# Altium schematic sheet LPCB228 - TOP.SchDoc
size A3; Address1: Factory 10; Address2: 9-13 Dingley Avenue, Dandeong, VICTORIA 3175, AUSTRALIA; DocumentNumber: 1; Revision: 1; SheetNumber: 1; SheetTotal: 2; Lockie__PCB_SUB_ASSEMBLY: Main; Lockie__PCB_ASSEMBLY: Main; Lockie__LDL: LPCB228; Lockie__PCB_DESCRIPTION: DC/DC Converter
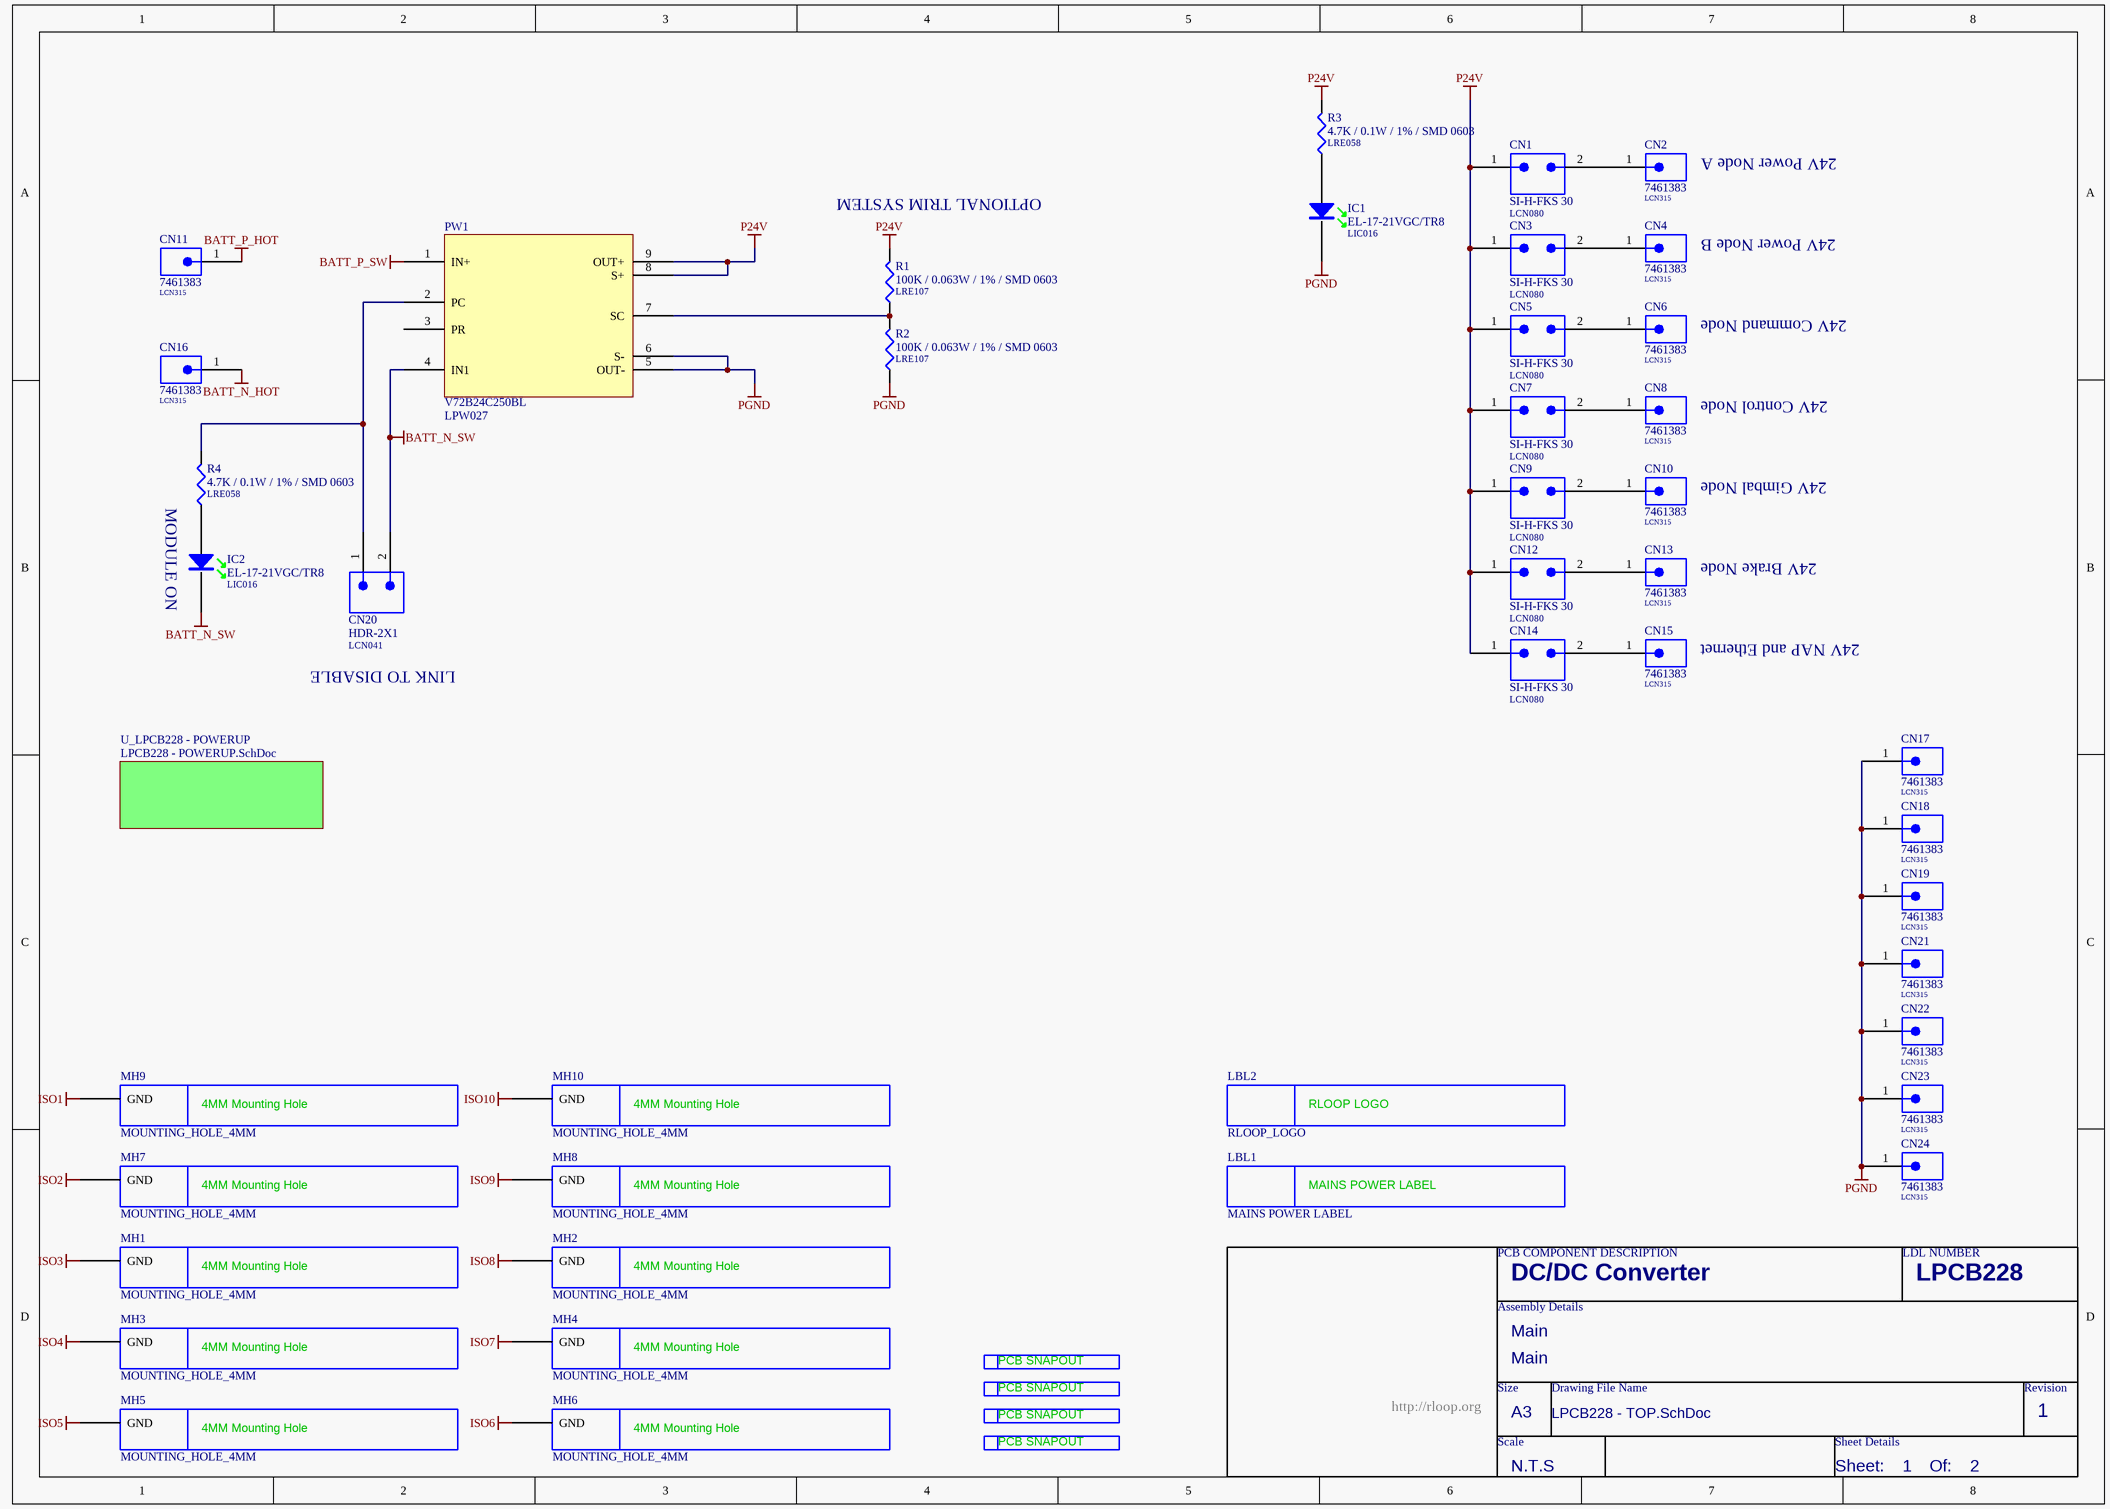
[diagram p0: LPCB228 - TOP.SchDoc]

## Parts
CN1  SI-H-FKS 30  LDL_NUMBER: LCN080  [SI-H-FKS-30]
CN2  7461383  LDL_NUMBER: LCN315  [7461383]
CN3  SI-H-FKS 30  LDL_NUMBER: LCN080  [SI-H-FKS-30]
CN4  7461383  LDL_NUMBER: LCN315  [7461383]
CN5  SI-H-FKS 30  LDL_NUMBER: LCN080  [SI-H-FKS-30]
CN6  7461383  LDL_NUMBER: LCN315  [7461383]
CN7  SI-H-FKS 30  LDL_NUMBER: LCN080  [SI-H-FKS-30]
CN8  7461383  LDL_NUMBER: LCN315  [7461383]
CN9  SI-H-FKS 30  LDL_NUMBER: LCN080  [SI-H-FKS-30]
CN10  7461383  LDL_NUMBER: LCN315  [7461383]
CN11  7461383  LDL_NUMBER: LCN315  [7461383]
CN12  SI-H-FKS 30  LDL_NUMBER: LCN080  [SI-H-FKS-30]
CN13  7461383  LDL_NUMBER: LCN315  [7461383]
CN14  SI-H-FKS 30  LDL_NUMBER: LCN080  [SI-H-FKS-30]
CN15  7461383  LDL_NUMBER: LCN315  [7461383]
CN16  7461383  LDL_NUMBER: LCN315  [7461383]
CN17  7461383  LDL_NUMBER: LCN315  [7461383]
CN18  7461383  LDL_NUMBER: LCN315  [7461383]
CN19  7461383  LDL_NUMBER: LCN315  [7461383]
CN20  HDR-2X1  LDL_NUMBER: LCN041  [HDR-2X1]
CN21  7461383  LDL_NUMBER: LCN315  [7461383]
CN22  7461383  LDL_NUMBER: LCN315  [7461383]
CN23  7461383  LDL_NUMBER: LCN315  [7461383]
CN24  7461383  LDL_NUMBER: LCN315  [7461383]
IC1  EL-17-21VGC/TR8  LDL_NUMBER: LIC016  [CR2012-0805-LED]
IC2  EL-17-21VGC/TR8  LDL_NUMBER: LIC016  [CR2012-0805-LED]
LBL1  MAINS POWER LABEL  [MAINS POWER LABEL]  (no BOM)
LBL2  RLOOP_LOGO  [RLOOP_LOGO]  (no BOM)
MH1  MOUNTING_HOLE_4MM  [MOUNTING_HOLE_4MM]  (no BOM)
MH2  MOUNTING_HOLE_4MM  [MOUNTING_HOLE_4MM]  (no BOM)
MH3  MOUNTING_HOLE_4MM  [MOUNTING_HOLE_4MM]  (no BOM)
MH4  MOUNTING_HOLE_4MM  [MOUNTING_HOLE_4MM]  (no BOM)
MH5  MOUNTING_HOLE_4MM  [MOUNTING_HOLE_4MM]  (no BOM)
MH6  MOUNTING_HOLE_4MM  [MOUNTING_HOLE_4MM]  (no BOM)
MH7  MOUNTING_HOLE_4MM  [MOUNTING_HOLE_4MM]  (no BOM)
MH8  MOUNTING_HOLE_4MM  [MOUNTING_HOLE_4MM]  (no BOM)
MH9  MOUNTING_HOLE_4MM  [MOUNTING_HOLE_4MM]  (no BOM)
MH10  MOUNTING_HOLE_4MM  [MOUNTING_HOLE_4MM]  (no BOM)
PW1  V72B24C250BL  LDL_NUMBER: LPW027  [FASTRAK_MINI_ONBOARD_MOUNT]
R1  100K / 0.063W / 1% / SMD 0603  LDL_NUMBER: LRE107  [LFP020__CR1608-0603-IPC7351_B]
R2  100K / 0.063W / 1% / SMD 0603  LDL_NUMBER: LRE107  [LFP020__CR1608-0603-IPC7351_B]
R3  4.7K / 0.1W / 1% / SMD 0603  LDL_NUMBER: LRE058  [LFP020__CR1608-0603-IPC7351_B]
R4  4.7K / 0.1W / 1% / SMD 0603  LDL_NUMBER: LRE058  [LFP020__CR1608-0603-IPC7351_B]
SN1  PCB_SNAPOUT  [SNAPOUT_NEW]  (value not drawn)  (no BOM)
SN2  PCB_SNAPOUT  [SNAPOUT_NEW]  (value not drawn)  (no BOM)
SN3  PCB_SNAPOUT  [SNAPOUT_NEW]  (value not drawn)  (no BOM)
SN4  PCB_SNAPOUT  [SNAPOUT_NEW]  (value not drawn)  (no BOM)

## Sub-sheets
U_LPCB228 - POWERUP = LPCB228 - POWERUP.SchDoc: no entries

## Nets
BATT_N_HOT: CN16.1
BATT_N_SW: CN20.2 IC2.K PW1.4(IN1)
BATT_P_HOT: CN11.1
BATT_P_SW: PW1.1(IN+)
ISO1: MH9.MOUNT(GND)
ISO2: MH7.MOUNT(GND)
ISO3: MH1.MOUNT(GND)
ISO4: MH3.MOUNT(GND)
ISO5: MH5.MOUNT(GND)
ISO6: MH6.MOUNT(GND)
ISO7: MH4.MOUNT(GND)
ISO8: MH2.MOUNT(GND)
ISO9: MH8.MOUNT(GND)
ISO10: MH10.MOUNT(GND)
P24V: CN1.1 CN3.1 CN5.1 CN7.1 CN9.1 CN12.1 CN14.1 PW1.8(S+) PW1.9(OUT+) R1.2 R3.2
PGND: CN17.1 CN18.1 CN19.1 CN21.1 CN22.1 CN23.1 CN24.1 IC1.K PW1.5(OUT-) PW1.6(S-) R2.1
NetCN1_2: CN1.2 CN2.1
NetCN3_2: CN3.2 CN4.1
NetCN5_2: CN5.2 CN6.1
NetCN7_2: CN7.2 CN8.1
NetCN9_2: CN9.2 CN10.1
NetCN12_2: CN12.2 CN13.1
NetCN14_2: CN14.2 CN15.1
NetCN20_1: CN20.1 PW1.2(PC) R4.2
NetIC1_A: IC1.A R3.1
NetIC2_A: IC2.A R4.1
NetPW1_7: PW1.7(SC) R1.1 R2.2

Not connected (* = marked no-connect by the designer): PW1 3(PR)

## Notes on the sheet
- 24V Power Node A
- (near R1) OPTIONAL TRIM SYSTEM
- 24V Power Node B
- 24V Command Node
- 24V Control Node
- 24V Gimbal Node
- 24V Brake Node
- (near IC2) MODULE ON
- 24V NAP and Ethernet
- LINK TO DISABLE
- PCB COMPONENT DESCRIPTION
- LDL NUMBER
- Assembly Details
- Size
- Drawing File Name
- Revision
- http://rloop.org
- Scale
- A3
- Sheet Details
- N.T.S
- Sheet:
- Of:
- (in symbol MOUNTING_HOLE_4MM) 4MM Mounting Hole
- (in symbol PCB_SNAPOUT) PCB SNAPOUT
- (in symbol RLOOP_LOGO) RLOOP LOGO

## Library data of the parts
CN1 CN3 CN5 CN7 CN9 CN12 CN14 = SI-H-FKS 30: Connector, Blade Fuse Holder, 5mm Terminals, 30A Max, PTH; FMEDA__CHANNEL: COM; FMEDA__OPERATING__CURRENT_MAX: 0; FMEDA__OPERATING__TEMP_MAX: 50; FMEDA__OPERATING__TEMP_MIN: -20; FMEDA__OPERATING__TEMP_TYP: 27; FMEDA__OPERATING__VOLTAGE_MAX: 16; FMEDA__OPERATING__VOLTAGE_TYP: 12; FMEDA__FUNCTION_IN_SYSTEM: *; FMEDA__OPERATING__CURRENT_MIN: 0; FMEDA__OPERATING__CURRENT_TYP: 0; FMEDA__OPERATING__VOLTAGE_MIN: 0
CN2 CN4 CN6 CN8 CN10 CN11 CN13 CN15-CN19 CN21-CN24 = 7461383: Terminal, Bush with M5 Shank; FMEDA__CHANNEL: COM; FMEDA__OPERATING__CURRENT_MAX: 0; FMEDA__OPERATING__TEMP_MAX: 50; FMEDA__OPERATING__TEMP_MIN: -20; FMEDA__OPERATING__TEMP_TYP: 27; FMEDA__OPERATING__VOLTAGE_MAX: 16; FMEDA__OPERATING__VOLTAGE_TYP: 12; FMEDA__OPERATING__CURRENT_MIN: 0; FMEDA__OPERATING__CURRENT_TYP: 0; FMEDA__OPERATING__VOLTAGE_MIN: 0
CN20 = HDR-2X1: Header, 2.54mm (0.1in), 2 Pins x 1 Row (40 Per Row In Strip); FMEDA__CHANNEL: COM; FMEDA__OPERATING__CURRENT_MAX: 0; FMEDA__OPERATING__TEMP_MAX: 50; FMEDA__OPERATING__TEMP_MIN: -20; FMEDA__OPERATING__TEMP_TYP: 27; FMEDA__OPERATING__VOLTAGE_MAX: 16; FMEDA__OPERATING__VOLTAGE_TYP: 12; FMEDA__OPERATING__CURRENT_MIN: 0; FMEDA__OPERATING__CURRENT_TYP: 0; FMEDA__OPERATING__VOLTAGE_MIN: 0; FMEDA__FUNCTION_IN_SYSTEM: *
IC1 IC2 = EL-17-21VGC/TR8: LED, SMD, 0805 Green [LIC016]; FMEDA__OPERATING__TEMP_MAX: 50; FMEDA__OPERATING__TEMP_MIN: -20; FMEDA__OPERATING__TEMP_TYP: 27; FMEDA__CHANNEL: COM; FMEDA__FUNCTION_IN_SYSTEM: *
LBL1 = MAINS POWER LABEL: FMEDA__CHANNEL: DIAG; FMEDA__FUNCTION_IN_SYSTEM: *
LBL2 = RLOOP_LOGO: FMEDA__CHANNEL: DIAG; FMEDA__FUNCTION_IN_SYSTEM: *
MH1-MH10 = MOUNTING_HOLE_4MM: 4MM Mouting Hole; FMEDA__CHANNEL: DIAG; FMEDA__FUNCTION_IN_SYSTEM: *
PW1 = V72B24C250BL: DC-DC Converter, 43-110VIN, 24V, 10A
R1 R2 = 100K / 0.063W / 1% / SMD 0603: Resistor, Ceramic Chip, 100K0, 0.063W, 1%, SMD 0603 [LRE107]; FMEDA__OPERATING__POWER_MAX: 0; FMEDA__OPERATING__TEMP_MAX: 50; FMEDA__OPERATING__TEMP_MIN: -20; FMEDA__OPERATING__TEMP_TYP: 27; FMEDA__CHANNEL: COM; Value: 100K; FMEDA__OPERATING__POWER_MIN: 0; FMEDA__OPERATING__VOLTAGE_MAX: 0; FMEDA__OPERATING__VOLTAGE_MIN: 0; FMEDA__OPERATING__VOLTAGE_TYP: 0; FMEDA__FUNCTION_IN_SYSTEM: *
R3 R4 = 4.7K / 0.1W / 1% / SMD 0603: Resistor, Ceramic Chip, 4K7, 0.1W, 1%, SMD 0603 [LRE058]; FMEDA__OPERATING__POWER_MAX: 0; FMEDA__OPERATING__TEMP_MAX: 50; FMEDA__OPERATING__TEMP_MIN: -20; FMEDA__OPERATING__TEMP_TYP: 27; FMEDA__CHANNEL: COM; VALUE: 4.7K; FMEDA__OPERATING__POWER_MIN: 0; FMEDA__OPERATING__VOLTAGE_MAX: 0; FMEDA__OPERATING__VOLTAGE_MIN: 0; FMEDA__OPERATING__VOLTAGE_TYP: 0; FMEDA__FUNCTION_IN_SYSTEM: *
SN1-SN4 = PCB_SNAPOUT: FMEDA__CHANNEL: DIAG; FMEDA__FUNCTION_IN_SYSTEM: *